# Altium schematic sheet Schematic.SchDoc
size A4
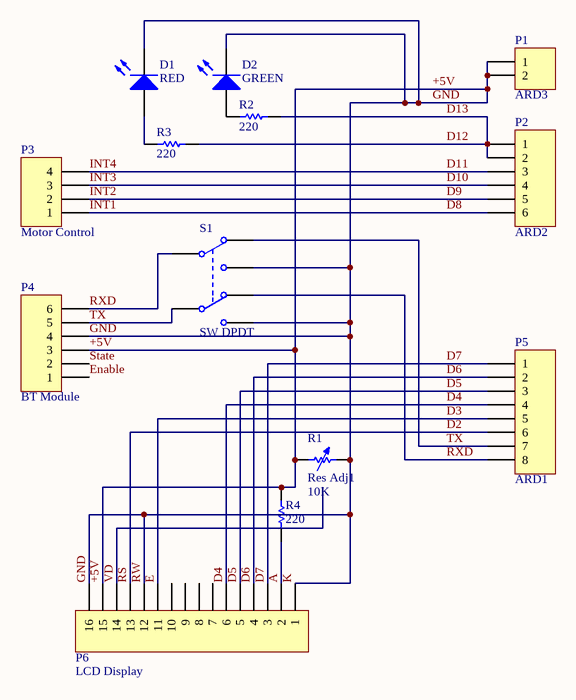
[diagram p0: Schematic.SchDoc]

## Parts
D1  RED  [LED-0]
D2  GREEN  [LED-0]
P1  ARD3  [HDR1X2H]
P2  ARD2  [HDR1X6H]
P3  Motor Control  [HDR1X4H]
P4  BT Module  [HDR1X6H]
P5  ARD1  [HDR1X8H]
P6  LCD Display  [HDR1X16]
R1  Res Adj1  value 10K  [AXIAL-0.7]
R2  220  [AXIAL-0.3]
R3  220  [AXIAL-0.3]
R4  220  [AXIAL-0.3]
S1  SW DPDT  [SOT23-6_N]

## Nets
+5V: D1.2(K) D2.2(K) P1.1 P1.2 P4.3 P4.4 P6.1 P6.12 P6.15 P6.16 R1.1 R1.2 R4.1 S1.3(NO1) S1.6(NO2)  [also labelled GND, K, RW]
A: P6.2 R4.2
D2: P5.6 P6.13  [also labelled RS]
D3: P5.5 P6.11  [also labelled E]
D4: P5.4 P6.6
D5: P5.3 P6.5
D6: P5.2 P6.4
D7: P5.1 P6.3
D8: P2.6 P3.1  [also labelled INT1]
D9: P2.5 P3.2  [also labelled INT2]
D10: P2.4 P3.3  [also labelled INT3]
D11: P2.3 P3.4  [also labelled INT4]
D12: P2.1 P2.2 R2.1 R3.1  [also labelled D13]
Enable: P4.1
RXD: P4.6 P5.8 S1.1(COMMON1) S1.4(NC2)
State: P4.2
TX: P4.5 P5.7 S1.2(NC1) S1.5(COMMON2)
VD: P6.14
NetD1_1: D1.1(A) R3.2
NetD2_1: D2.1(A) R2.2

Not connected (* = marked no-connect by the designer): P6 7 8 9 10

## Library data of the parts
D1 D2 = LED0: Typical INFRARED GaAs LED; Published: 8-Jun-2000; LatestRevisionDate: 08-Jul-2005; LatestRevisionNote: Mech Layer 1 removed.; PackageReference: LED-0; Publisher: Altium Limited; PackageDescription: LED; 2 Leads
P1 = Header 2H: Header, 2-Pin, Right Angle; LatestRevisionDate: 17-Jul-2002; LatestRevisionNote: Re-released for DXP Platform.; Publisher: Altium Limited
P2 P4 = Header 6H: Header, 6-Pin, Right Angle; LatestRevisionDate: 17-Jul-2002; LatestRevisionNote: Re-released for DXP Platform.; Publisher: Altium Limited
P3 = Header 4H: Header, 4-Pin, Right Angle; LatestRevisionDate: 17-Jul-2002; LatestRevisionNote: Re-released for DXP Platform.; Publisher: Altium Limited
P5 = Header 8H: Header, 8-Pin, Right Angle; LatestRevisionDate: 17-Jul-2002; LatestRevisionNote: Re-released for DXP Platform.; Publisher: Altium Limited
P6 = Header 16: Header, 16-Pin; LatestRevisionDate: 17-Jul-2002; LatestRevisionNote: Re-released for DXP Platform.; Publisher: Altium Limited
R1 = Res Adj1: Variable Resistor; Set Position: 0.5; Published: 8-Jun-2000; LatestRevisionDate: 17-Jul-2002; LatestRevisionNote: Re-released for DXP Platform.; PackageReference: AXIAL-0.7; Publisher: Altium Limited; PackageDescription: Axial Device, Thru-Hole; 2 Leads; 0.7 in Pin Spacing
R2-R4 = Res1: Resistor; Published: 8-Jun-2000; LatestRevisionDate: 17-Jul-2002; LatestRevisionNote: Re-released for DXP Platform.; PackageReference: AXIAL-0.3; Publisher: Altium Limited; PackageDescription: Axial Device, Thru-Hole; 2 Leads; 0.3 in Pin Spacing
S1 = SW DPDT: Switch; Published: 24-Mar-1999; LatestRevisionDate: 29-May-2009; LatestRevisionNote: IPC-7351 Footprint Added.; PackageVersion: Mar-2001; PackageReference: SOT23-6; Publisher: Altium Limited; PackageDescription: 6-Pin SOT-23 Package 0.95 mm Pitch, 2.7 mm Lead Span; Code_JEITA: SC-74; Code_IPC: SOT26A-6